# Altium schematic sheet Control_Freq.SchDoc: Control de Frecuencia
size A4
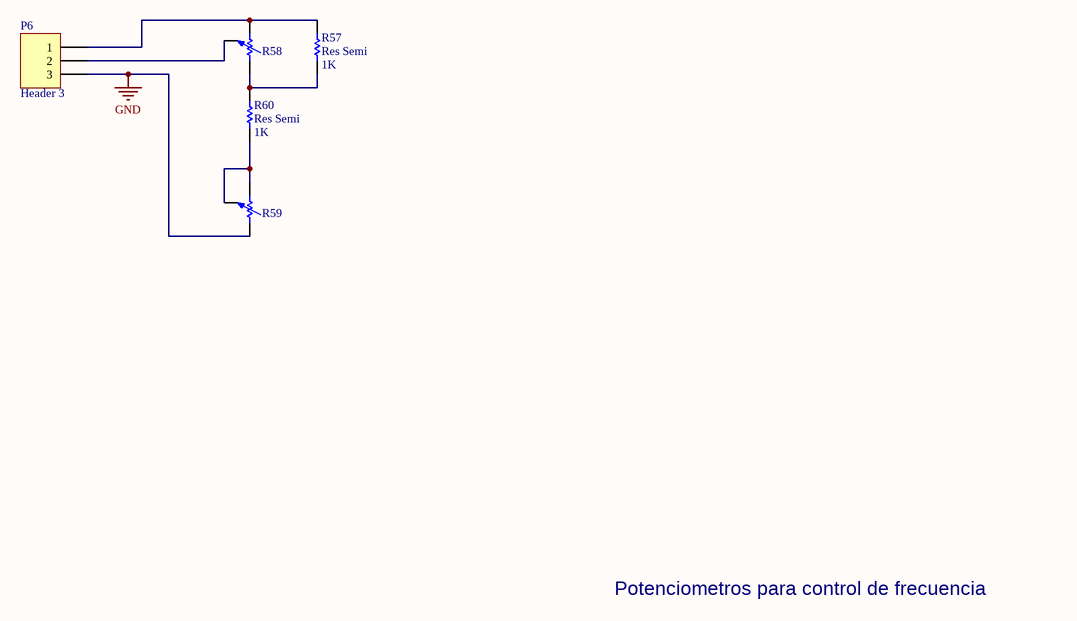
[diagram p0: Control_Freq.SchDoc]

## Parts
P6  Header 3  [HDR1X3]
R57  Res Semi  value 1K  [2012[0805]]
R58  Pot  [POT-eje2]  (value not drawn)
R59  Pot  [POT-eje2]  (value not drawn)
R60  Res Semi  value 1K  [2012[0805]]

## Nets
GND: P6.3 R59.1
NetP6_1: P6.1 R57.2 R58.2
NetP6_2: P6.2 R58.3
NetR57_1: R57.1 R58.1 R60.2
NetR59_2: R59.2 R59.3 R60.1

## Notes on the sheet
- Potenciometros para control de frecuencia

## Library data of the parts
P6 = Header 3: Header, 3-Pin; LatestRevisionDate: 17-Jul-2002; LatestRevisionNote: Re-released for DXP Platform.; Publisher: Altium Limited
R57 R60 = Res Semi: Semiconductor Resistor; Published: 8-Jun-2000; LatestRevisionDate: 17-Jul-2002; LatestRevisionNote: Re-released for DXP Platform.; PackageReference: AXIAL-0.5; Publisher: Altium Limited
R58 R59 = Pot: pin to pad: 2>3 3>2